# Altium schematic sheet Converter_Dif-Se.SchDoc
size A
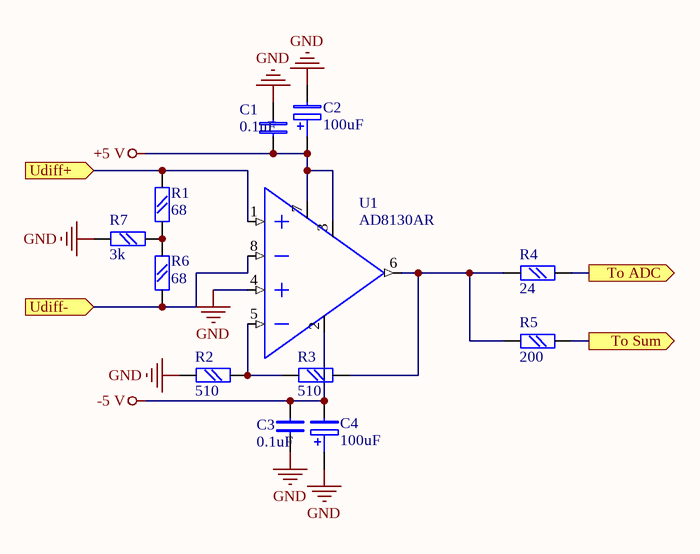
[diagram p0: Converter_Dif-Se.SchDoc]

## Parts
C1  0.1uF  [chip0805]
C2  100uF  [CEL-SMD300]
C3  0.1uF  [chip0805]
C4  100uF  [CEL-SMD300]
R1  68  [chip0805]
R2  510  [chip0805]
R3  510  [chip0805]
R4  24  [chip0805]
R5  200  [chip0805]
R6  68  [chip0805]
R7  3k  [chip0805]
U1  AD8130AR  [SO-8]

## Ports
To ADC (out), To Sum (out), Udiff+ (in), Udiff- (in)

## Nets
+5 V: C1.2 C2.+ U1.3(PD) U1.7(E+)
-5 V: C3.1 C4.- U1.2(E-)
GND: C1.1 C2.- C3.2 C4.+ R2.1 R7.2 U1.4(IN+)
To ADC: R4.2 ; port To ADC
To Sum: R5.2 ; port To Sum
Udiff+: R1.1 U1.1(+IN) ; port Udiff+
Udiff-: R6.2 U1.8(-IN) ; port Udiff-
NetR1_2: R1.2 R6.1 R7.1
NetR2_2: R2.2 R3.1 U1.5(IN-)
NetR3_2: R3.2 R4.1 R5.1 U1.6(OUT)

## Library data of the parts
C1 C3 = C: Text Field1: 20; Text Field2: 10
C2 C4 = C POL: Text Field1: 20; Text Field2: 20
R1-R7 = R: Text Field1: 20; Text Field2: 20
U1 = AD8130